# EAGLE design EmprendaR4b (EAGLE 8.0.0)
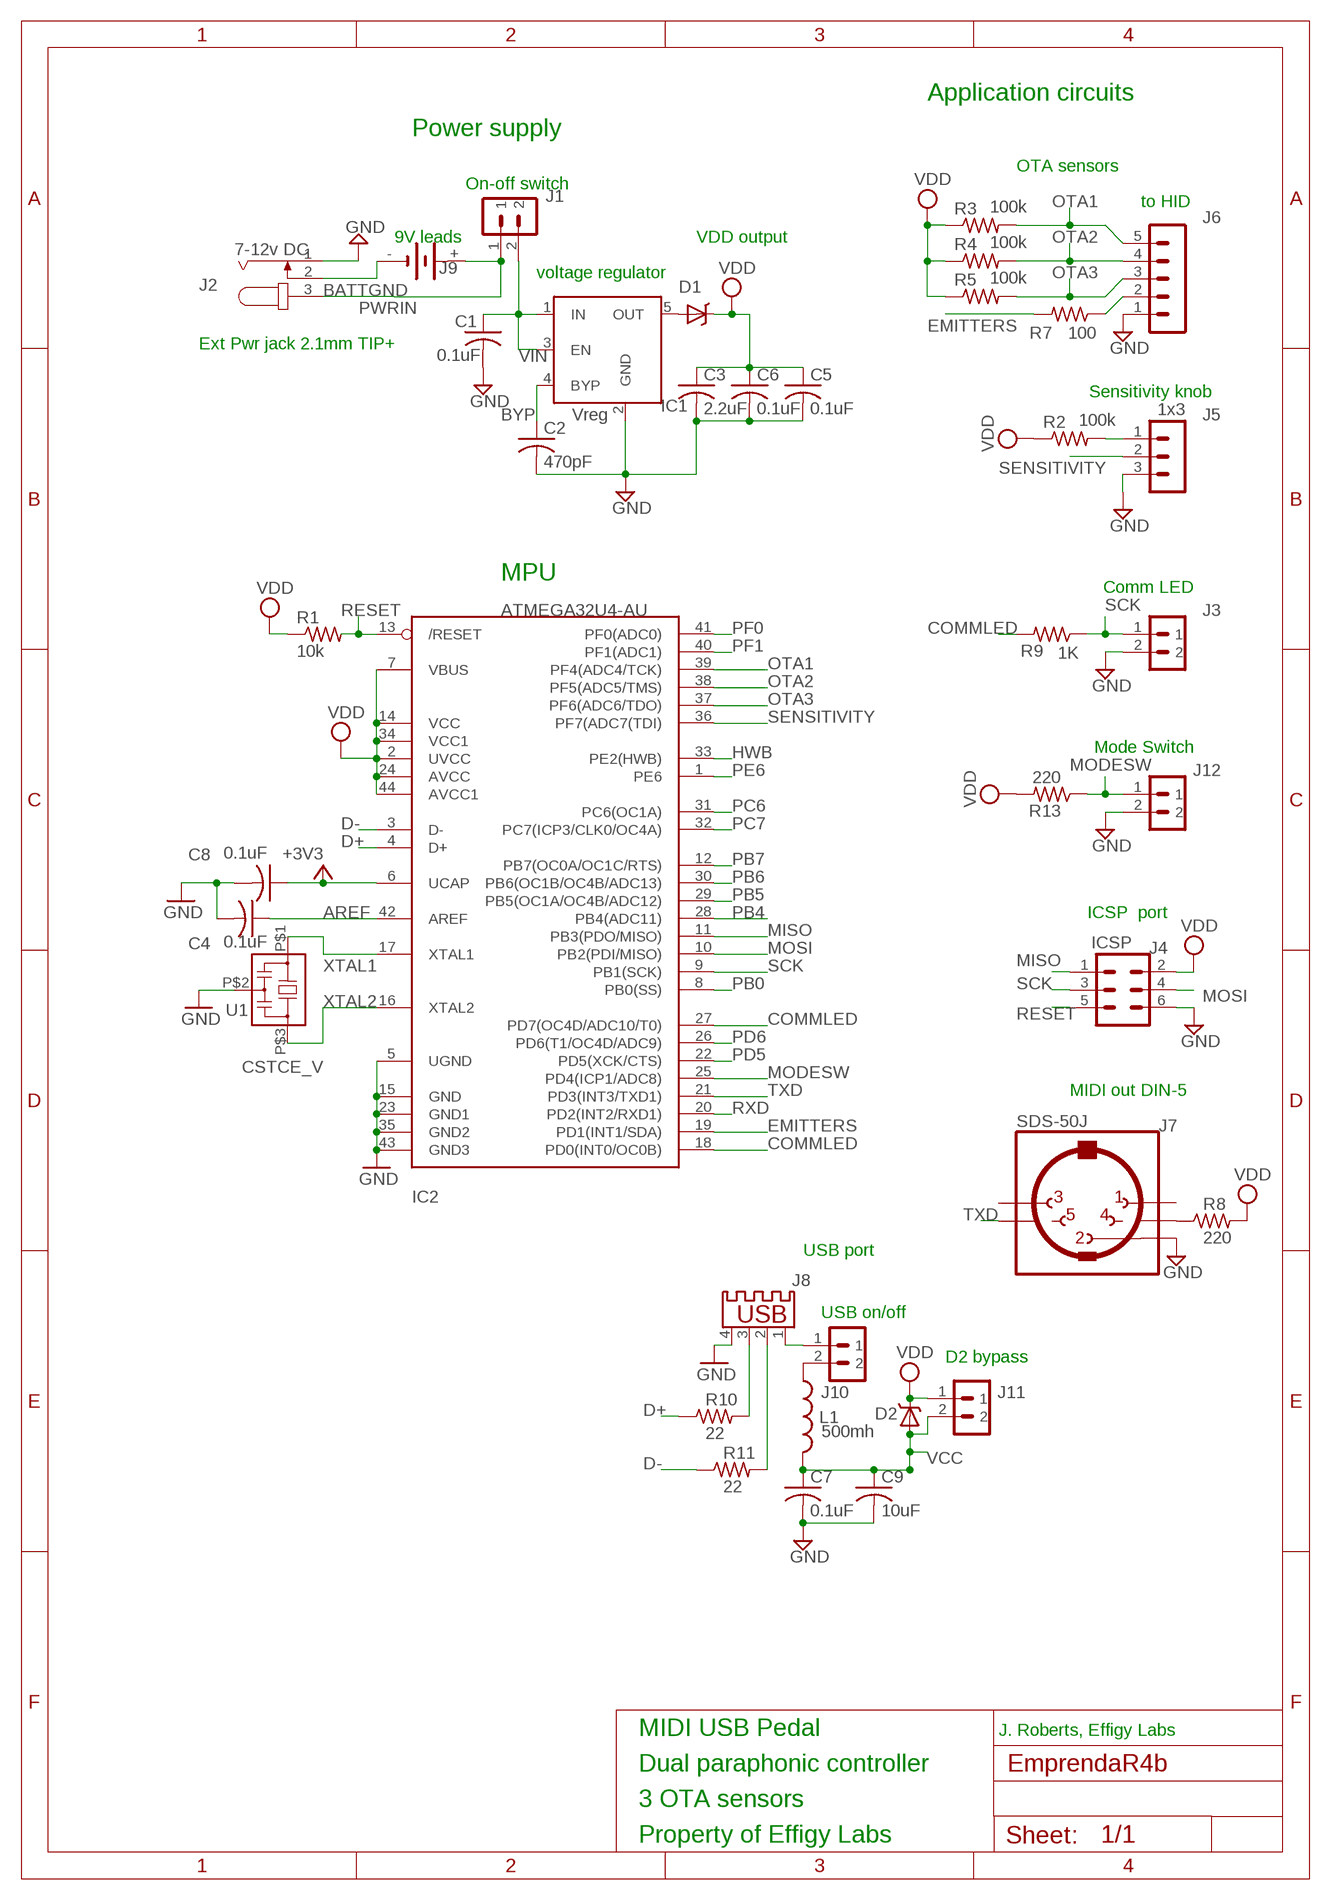
[diagram p0: schematic, sheet 1]

## Parts
C1  0.1uF  C-USC1206  [C1206]
C2  470pF  C-USC0603  [C0603]
C3  2.2uF  C-USC1206  [C1206]
C4  0.1uF  C-USC0603  [C0603]
C5  0.1uF  C-USC0603  [C0603]
C6  0.1uF  C-USC0603  [C0603]
C7  0.1uF  C-USC1206  [C1206]
C8  0.1uF  C-USC0603  [C0603]
C9  10uF  C-USC1206  [C1206]
D1  DIODE-SCHOTTKY_  [SMA-DIODE]
D2  DIODE-SCHOTTKY_  [SMA-DIODE]
IC1  Vreg  MIC5219XX  [SOT23-5]
IC2  ATMEGA32U4-AU  [TQFP44]
J1  SW1  MA02-1  [MA02-1]
J2  7-12v DC  JACK-PLUG0  [SPC4077]
J3  LED  MA02-1  [MA02-1]
J4  ICSP  MA03-2  [MA03-2]
J5  1x3  MA03-1  [MA03-1]
J6  Pedal  MA05-1  [MA05-1]
J7  SDS-50J  SDS-50JSDS-50J  [SDS-50J]
J8  B  61729-0010BLF61729-0010BLF  [61729-0010BLF]
J9  BATTERY-9V  [9V-BATTERY-SNAP]
J10  SW1  MA02-1  [MA02-1]
J11  USB-vdd  MA02-1  [MA02-1]
J12  LED  MA02-1  [MA02-1]
L1  500mh  INDUCTOR0805  [0805]
R1  10k  R-US_R0805  [R0805]
R2  100k  R-US_R0805  [R0805]
R3  100k  R-US_R0805  [R0805]
R4  100k  R-US_R0805  [R0805]
R5  100k  R-US_R0805  [R0805]
R7  100  R-US_R0805  [R0805]
R8  220  R-US_R0805  [R0805]
R9  1K  R-US_R0805  [R0805]
R10  22  R-US_R0805  [R0805]
R11  22  R-US_R0805  [R0805]
R13  220  R-US_R0805  [R0805]
U1  CSTCE_V  [CSTCE_V]

## Nets
+3V3: C8.1 IC2.6(UCAP)
AREF: C4.1 IC2.42(AREF)
BATTGND [bat]: J2.2 J9.-
BYP: C2.1 IC1.4(BYP)
COMMLED: IC2.18(PD0(INT0/OC0B)) IC2.27(PD7(OC4D/ADC10/T0)) R9.2
D+: IC2.4(D+) R10.1
D-: IC2.3(D-) R11.1
EMITTERS: IC2.19(PD1(INT1/SDA)) R7.2
EP: J6.2 R7.1
GND [gnd]: C1.2 C2.2 C3.2 C4.2 C5.2 C6.2 C7.2 C8.2 C9.2 IC1.2(GND) IC2.5(UGND) IC2.15(GND) IC2.23(GND1) IC2.35(GND2) IC2.43(GND3) J2.1 J3.2 J4.6 J5.3 J6.1 J7.P$2 J8.4 J12.2 U1.P$2
HWB: IC2.33(PE2(HWB))
MIDIPWR: J7.P$4 R8.1
MISO: IC2.11(PB3(PDO/MISO)) J4.1
MODESW: IC2.25(PD4(ICP1/ADC8)) J12.1 R13.1
MOSI: IC2.10(PB2(PDI/MISO)) J4.4
N$8 [power]: J8.1 J10.1
OTA1: IC2.39(PF4(ADC4/TCK)) J6.5 R3.2
OTA2: IC2.38(PF5(ADC5/TMS)) J6.4 R4.2
OTA3: IC2.37(PF6(ADC6/TDO)) J6.3 R5.2
PB0: IC2.8(PB0(SS))
PB4: IC2.28(PB4(ADC11))
PB5: IC2.29(PB5(OC1A/OC4B/ADC12))
PB6: IC2.30(PB6(OC1B/OC4B/ADC13))
PB7: IC2.12(PB7(OC0A/OC1C/RTS))
PC6: IC2.31(PC6(OC1A))
PC7: IC2.32(PC7(ICP3/CLK0/OC4A))
PD5: IC2.22(PD5(XCK/CTS))
PD6: IC2.26(PD6(T1/OC4D/ADC9))
PE6: IC2.1(PE6)
PF0: IC2.41(PF0(ADC0))
PF1: IC2.40(PF1(ADC1))
PWRIN [bat]: J1.1 J2.3 J9.+
RESET: IC2.13(/RESET) J4.5 R1.2
RVOUT [power]: D1.A IC1.5(OUT)
RXD: IC2.20(PD2(INT2/RXD1))
SCK: IC2.9(PB1(SCK)) J3.1 J4.3 R9.1
SENSITIVITY: IC2.36(PF7(ADC7(TDI)) J5.2
SENSPWR: J5.1 R2.2
TXD: IC2.21(PD3(INT3/TXD1)) J7.P$5
USB_D+: J8.3 R10.2
USB_D-: J8.2 R11.2
VBUS [power]: J10.2 L1.1
VCC [power]: C7.1 C9.1 D2.A J11.2 L1.2
VDD [power]: C3.1 C5.1 C6.1 D1.C D2.C IC2.2(UVCC) IC2.7(VBUS) IC2.14(VCC) IC2.24(AVCC) IC2.34(VCC1) IC2.44(AVCC1) J4.2 J11.1 R1.1 R2.1 R3.1 R4.1 R5.1 R8.2 R13.2
VIN [power]: C1.1 IC1.1(IN) IC1.3(EN) J1.2
XTAL1: IC2.17(XTAL1) U1.P$1
XTAL2: IC2.16(XTAL2) U1.P$3
Unconnected: J7.P$1 J7.P$3

## Notes on the sheet
- Application circuits
- Power supply
- OTA sensors
- On-off switch
- to HID
- 9V leads | VDD output
- voltage regulator
- Ext Pwr jack 2.1mm TIP+
- Sensitivity knob
- MPU | Comm LED
- Mode Switch
- ICSP  port
- MIDI out DIN-5
- USB port
- USB on/off
- D2 bypass
- MIDI USB Pedal | J. Roberts, Effigy Labs
- Dual paraphonic controller
- 3 OTA sensors
- Property of Effigy Labs

## Library data of the parts
C1 = rcl:C-US: CAPACITOR, American symbol; MF: AVX CORPORATION; MPN: 0603YC104KAT2A; OC_DIGI-KEY: 478-1239-1-ND; OC_NEWARK: 85K9474
C2 = rcl:C-US: CAPACITOR, American symbol; MF: TDK CORPORATION; MPN: C1608X7R1H471K; OC_DIGI-KEY: 445-1307-1-ND; OC_NEWARK: 96M1104
C3 C5-C9 = rcl:C-US: CAPACITOR, American symbol
C4 = rcl:C-US: CAPACITOR, American symbol; MF: AVX CORPORATION; MPN: 0603YC104KAT2A; OC_DIGIKEY: 478-1239-1-ND; OC_NEWARK: 85K9474
D1 D2 = SparkFun-DiscreteSemi:DIODE-SCHOTTKY: Commonly MBRA140.
IC1 = v-reg-micrel:MIC5219XX: VOLTAGE REGULATOR; MF: Exar; MPN: SPX5205M5-L-5-0; OC_DIGI-KEY: 1016-1419-ND; OC_NEWARK: unknown
IC2 = adaprog:ATMEGA32U4
J1 J3 J10-J12 = divers:MA02-1: PIN HEADER
J2 = con-jack:JACK-PLUG: DC POWER JACK Power Jack, DC, Right Angle, Through Hole, Rated 5A at 16VDC, PC Terminals Distributor: Farnell (www.Farnell.de) Drawing: 84N1161.pdf / 84N1162.pdf Manufacturer: SPC Technology (www.spctechnology.com) Type: SPC4077 / SPC 4078; MF: SPC; MPN: SPC21364; OC_FARNELL: unknown; OC_NEWARK: 11M0559
J4 = con-lstb:MA03-2: PIN HEADER; MF: FCI; MPN: 20021111-00006T4LF; OC_DIGI-KEY: 609-3710-ND; OC_NEWARK: unknown
J5 = con-lstb:MA03-1: PIN HEADER; OC_FARNELL: unknown; OC_NEWARK: unknown
J6 = con-lstb:MA05-1: PIN HEADER; MF: JST Sales America; MPN: 05HR-6S-P-N; OC_DIGI-KEY: 05HR-6S-P-N<-ND; OC_FARNELL: unknown; OC_NEWARK: unknown
J7 = cui_sds:SDS-50J; VALUE: J7
J8 = con-fci-usb:61729-0010BLF: USB connector
J9 = Power Jacks:BATTERY-9V: 9V battery; OC_NEWARK: unknown
L1 = SparkFun-Passives:INDUCTOR: Inductors Basic Inductor/Choke - 0603 and 1206. Footprints are not proven and vary greatly between part numbers.
R1 = resistor:R-US_: RESISTOR, American symbol; MF: Panasonic Electronic Components; MPN: ERJ-3EKF1002V; OC_DIGI-KEY: P10KACT-ND; OC_NEWARK: unknown
R2-R5 R7 R8 R13 = resistor:R-US_: RESISTOR, American symbol; MF: Panasonic Electronic Components; MPN: ERJ-6GEYJ104V; OC_DIGI-KEY: P100KACT-ND
R9 = resistor:R-US_: RESISTOR, American symbol; MF: Panasonic Electronic Components; MPN: ERJ-6GEYJ103V; OC_DIGI-KEY: P10KACT-ND
R10 R11 = resistor:R-US_: RESISTOR, American symbol
U1 = murata-filter:CSTCE_V; MF: Murata Electronics North America; MPN: CSTCE16M0V53-R0; OC_DIGI-KEY: 490-1198-1-ND; OC_NEWARK: unknown

## Net classes
0 default: width 0.305 mm, drill 0.559 mm, clearance 0.254 mm
1 power: width 0.406 mm, drill 0.559 mm, clearance 0.254 mm
2 gnd: width 0.406 mm, drill 0.559 mm, clearance 0.254 mm
3 bat: width 0.61 mm, drill 0.559 mm, clearance 0.254 mm

## Board
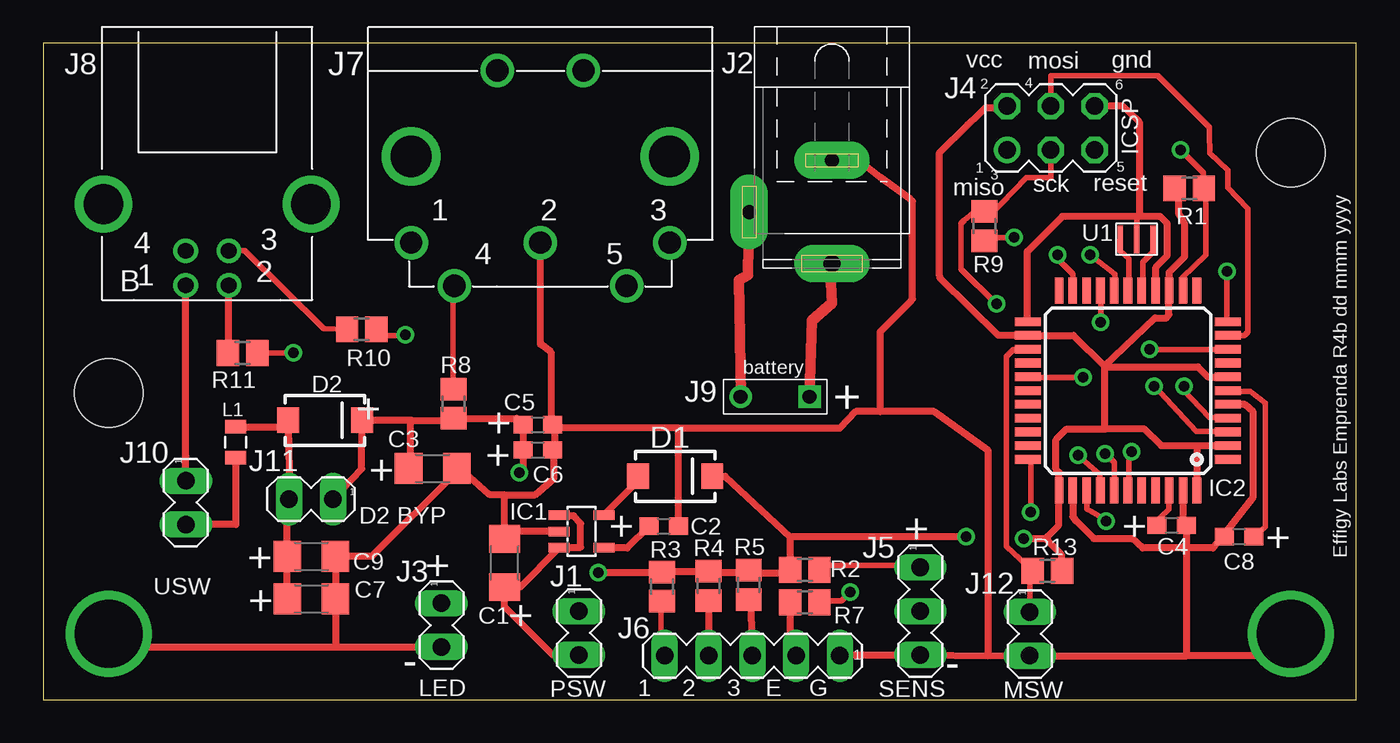
[diagram p1: board, top side]
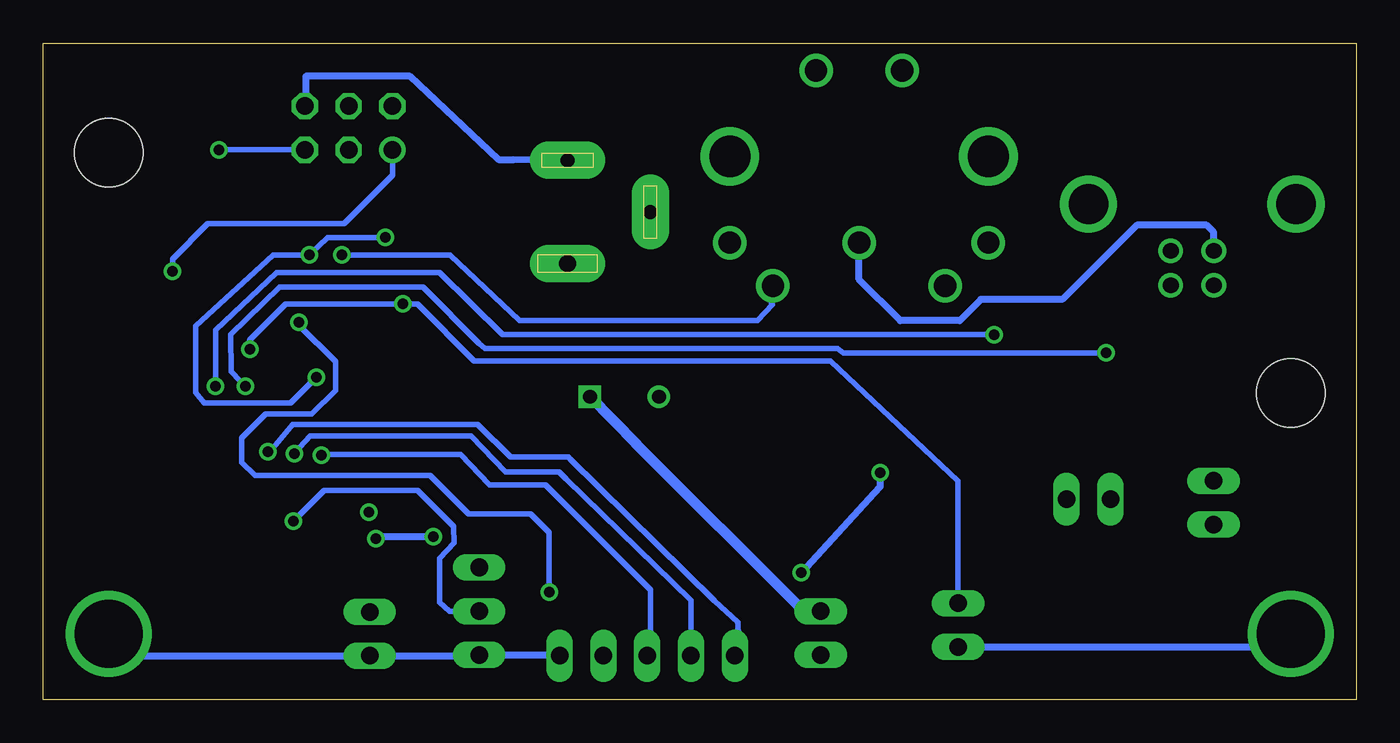
[diagram p2: board, bottom side, seen from below]

Size 76.2 x 38.1 mm. Coordinates in mm from the lower left corner, seen from the top.
Outline: 0,0 76.2,0 76.2,38.1 0,38.1 0,0
Copper layers (1*16): Top 0.035mm / dielectric 1.5mm / Bottom 0.035mm
Design rules "default *": minimum track width 10mil, minimum drill 24mil, track to track 8mil, track to pad 8mil, pad to pad 8mil, via to via 8mil, smd to smd 8mil, copper to edge 40mil, drill to drill 8mil, minimum pad ring 10mil, minimum via ring 8mil, stop-mask expansion 4mil, vias tented up to drill 0mil, thermal gap 10mil
Holes 3.96 mm at 72.39,31.75 3.81,17.78
tKeepout: area 8.9,22.6 to 11.4,24.7; area 53.3,30.1 to 62,35.9; area 7.3,21.2 to 12.7,26.3; area 19.9,21.5 to 37.9,27.2; area 32.7,2.5 to 35.7,5.4; area 25.9,2.6 to 28.9,5.2; area 53.3,3 to 54.9,4.5; area 53.2,5.5 to 55,7.1; area 58.7,3.2 to 60.4,4.4; area 64.2,3 to 66.2,4.7; area 6.7,11.3 to 9,13.7; area 13.9,8 to 16.4,9.8
bKeepout: area 69.2,32.4 to 77.8,38.2; area 38.2,21.9 to 48.8,31.6; area 45.4,0.3 to 59.9,5.1; area 7.6,21.1 to 12.9,26.1; area 33.2,2.4 to 35.2,4.9; area 26.6,2.9 to 28.2,4.9; area 53.7,2.7 to 54.8,7.3; area 59,2.7 to 59.7,4.6; area 7.4,11.7 to 8.7,13.1; area 13.8,8.4 to 15.4,9.6
tRestrict: area 31,1.8 to 31.8,3.8
bRestrict: area 55,31.8 to 60,34.2; area 62.2,4.9 to 63.3,7.1; area 56.1,1.7 to 57.2,3.8; area 51.1,1.6 to 52,3.8; area 40.8,1.8 to 41.7,4.1; area 30.8,1.7 to 32,3.8; area 29.9,7.2 to 31.1,10.7

### Footprints (pad centres in the part's own frame; a part is rotated, then mirrored left to right if it is on the bottom)
C1206 = smd 1.6 x 1.8: 1 -1.4,0; 2 1.4,0
C0603 = smd 1.1 x 1: 1 -0.85,0; 2 0.85,0
SMA-DIODE = smd 1.27 x 1.47: A -2.15,0; C 2.15,0
SOT23-5 = smd 0.55 x 1.2: 1 -0.95,-1.3; 2 0,-1.3; 3 0.95,-1.3; 4 0.95,1.3; 5 -0.95,1.3
TQFP44 = smd 1.5 x 0.5: 1 -5.8,4; 2 -5.8,3.2; 3 -5.8,2.4; 4 -5.8,1.6; 5 -5.8,0.8; 6 -5.8,0; 7 -5.8,-0.8; 8 -5.8,-1.6; 9 -5.8,-2.4; 10 -5.8,-3.2; 11 -5.8,-4; 23 5.8,-4; 24 5.8,-3.2; 25 5.8,-2.4; 26 5.8,-1.6; 27 5.8,-0.8; 28 5.8,0; 29 5.8,0.8; 30 5.8,1.6; 31 5.8,2.4; 32 5.8,3.2; 33 5.8,4 | smd 0.5 x 1.5: 12 -4,-5.8; 13 -3.2,-5.8; 14 -2.4,-5.8; 15 -1.6,-5.8; 16 -0.8,-5.8; 17 0,-5.8; 18 0.8,-5.8; 19 1.6,-5.8; 20 2.4,-5.8; 21 3.2,-5.8; 22 4,-5.8; 34 4,5.8; 35 3.2,5.8; 36 2.4,5.8; 37 1.6,5.8; 38 0.8,5.8; 39 0,5.8; 40 -0.8,5.8; 41 -1.6,5.8; 42 -2.4,5.8; 43 -3.2,5.8; 44 -4,5.8
MA02-1 = drill 1.016 long: 1 -2.54,0; 2 0,0
SPC4077 = drill 0.8 pad 2.184 long: 1 -3,0; 2 0,-4.8 | drill 1 pad 2.184 long: 3 3,0
MA03-2 = drill 1.016: 1 -2.54,-1.27 | drill 1.016 octagon: 2 -2.54,1.27; 3 0,-1.27; 4 0,1.27; 5 2.54,-1.27; 6 2.54,1.27
MA03-1 = drill 1.016 long: 1 -2.54,0; 2 0,0; 3 2.54,0
MA05-1 = drill 1.016 long: 1 -5.08,0; 2 -2.54,0; 3 0,0; 4 2.54,0; 5 5.08,0
SDS-50J = drill 1.295: P$1 -7.5,0; P$2 0,0; P$3 7.5,0; P$4 -5,-2.5; P$5 5,-2.5; P$6 -2.502,10; P$7 2.502,10 | drill 2.388: P$8 -7.5,5.004; P$9 7.5,5.004
61729-0010BLF = drill 0.92: 1 -1.25,-4.71; 2 1.25,-4.71; 3 1.25,-2.71; 4 -1.25,-2.71 | drill 2.3: NC 6.02,0; NC2 -6.02,0
9V-BATTERY-SNAP = drill 0.8 square: + -2,0 | drill 0.8: - 2,0
0805 = smd 0.8 x 1.2: 1 -0.9,0; 2 0.9,0
R0805 = smd 1.3 x 1.5: 1 -0.85,0; 2 0.85,0
CSTCE_V = smd 0.3 x 1.6: P$1 -0.95,0; P$2 0,0; P$3 0.95,0

### Placement (x,y rotation side)
C1  26.77,7.92 90 top
C2  36.02,10.06 0 top
C3  22.61,13.41 0 top
C4  65.48,10.11 0 top
C5  28.7,15.95 0 top
C6  28.7,14.48 0 top
C7  15.57,5.84 0 top
C8  69.39,9.45 180 top
C9  15.57,8.31 0 top
D1  36.68,12.95 0 top
D2  16.36,16.21 0 top
IC1  31.24,9.75 270 top
IC2  62.94,17.93 180 top
J1  31.09,2.59 270 top
J2  45.77,28.3 270 top
J3  23.11,3.05 270 top
J4  58.47,33.17 0 top
J5  50.9,5.13 270 top
J6  41.15,2.54 180 top
J7  28.85,26.52 0 top
J8  9.53,28.75 0 top
J9  42.47,17.58 180 top
J10  8.28,10.16 270 top
J11  14.27,11.63 180 top
J12  57.25,2.54 270 top
L1  11.18,14.94 90 top
R1  66.5,29.67 0 top
R2  44.2,7.52 0 top
R3  35.92,6.55 270 top
R4  38.61,6.6 270 top
R5  40.94,6.65 270 top
R7  44.2,5.64 0 top
R8  23.83,17.17 270 top
R9  54.61,27.48 270 top
R10  18.49,21.49 180 top
R11  11.58,20.12 180 top
R13  58.27,7.47 0 top
U1  63.45,26.72 0 top

### Tracks (layer width: path | path; a pad name or v marks a point on that pad's centre or on a via)
+3V3
  Top 0.305: IC2.6 68.89,17.88 70.05,17.88 70.92,17.22 70.92,10.02 C8.1
AREF
  Top 0.305: C4.1 64.82,10.57 65.33,11.02 65.33,12.04 IC2.42
BATTGND
  Top 0.61: J2.2 40.89,24.64 40.39,24.33 40.49,17.56 J9.-
BYP
  Top 0.305: IC1.4 32.61,8.89
  Top 0.406: C2.1 35.15,10.06 33.88,8.79 32.56,8.79 IC1.4
COMMLED  (via drill 0.61)
  Top 0.305: 62.18,23.57 IC2.18 62.18,23.77 62.18,24.69 v60.76,25.81 | 57.1,18.69 IC2.27 57.3,18.69 v60.35,18.69 | v56.34,26.82 54.66,26.82 R9.2
  Bottom 0.305: v56.34,26.82 59.69,26.82 v60.76,25.81 62.84,25.81 67.36,21.69 67.36,17.83 66.85,17.22 61.82,17.22 v60.35,18.69
D+  (via drill 0.61)
  Top 0.305: IC2.4 68.68,16.36 67.67,16.36 66.19,17.93 v66.19,18.19 | v21.03,21.18 20.98,21.13 19.71,21.13 19.51,21.34 R10.1
  Top 0.406: 68.72,16.31 IC2.4
  Bottom 0.305: v21.03,21.18 49.53,21.18 53.19,24.79 62.64,24.79 66.19,21.44 v66.19,18.19
D-  (via drill 0.61)
  Top 0.305: v14.53,20.12 R11.1 | 68.78,15.49 IC2.3 68.68,15.54 66.9,15.54 v64.47,18.19
  Bottom 0.305: v14.53,20.12 29.77,20.12 30.12,20.37 50.55,20.37 50.9,20.68 54.15,23.93 62.48,23.93 65.33,21.18 65.28,19.05 64.77,18.49 v64.47,18.19
EMITTERS  (via drill 0.61)
  Top 0.305: v46.84,6.25 46.33,5.74 45.21,5.74 R7.2 | IC2.19 61.37,23.57 v61.37,21.89
  Bottom 0.305: v46.84,6.25 46.84,9.7 47.9,10.77 51.51,10.77 53.75,13.01 63.91,13.01 64.67,13.77 64.67,15.19 63.3,16.56 60.6,16.56 59.23,17.93 59.23,19.61 61.37,21.74 v61.37,21.89
EP
  Top 0.406: R7.1 43.33,3.06 J6.2
GND  (via drill 3.96 pad 3.81)
  Top 0.305: 63.45,28.04 U1.P$2 | C8.2 68.48,9.45 68.37,9.34 | 29.46,16.04 C5.2
  Top 0.406: J4.6 62.64,34.44 63.6,33.53 63.6,28.04 | 63.6,28.04 64.82,28.04 65.23,27.64 65.23,25.76 64.57,25.09 64.57,23.72 IC2.15 | 63.6,28.04 63.45,28.04 59.13,28.04 57.1,26.01 57.1,21.95 IC2.23 | IC2.35 59.74,11.99 59.74,10.62 59.94,10.36 60.96,9.35 63.2,9.35 63.8,8.79 66.29,8.79 | 29.67,16.05 C5.2 | 66.34,8.79 66.34,2.56 | 47.4,31.24 J2.1 47.22,31.29 47.3,31.29 48.56,30.31 50.34,29.01 50.44,28.91 50.44,23.25 50.34,23.11 48.56,21.34 48.56,16.71 | 36.78,15.75 29.72,15.75 29.74,15.83 29.67,15.83 C5.2 | 36.78,15.75 46.23,15.75 47.14,16.71 48.56,16.71 | IC2.5 68.89,17.12 69.75,17.12 70.21,16.71 70.21,11.73 68.37,9.34 67.9,8.82 67.87,8.79 66.34,8.79 | v3.81,3.81 4.57,3.05 16.97,3.05 | C5.2 29.67,15.65 29.67,14.63 C6.2 29.62,14.41 29.62,12.8 29.43,12.64 28.55,11.89 26.77,11.89 | 26.77,11.89 25.91,11.89 24.18,13.41 C3.2 | 29.77,9.8 IC1.2 27.2,9.75 C1.2 26.77,11.89 | 24.59,12.8 C3.2 | 68.28,9.35 C8.2 | 66.34,8.79 66.29,8.79 | 66.33,8.83 66.34,8.79 | 66.09,8.79 66.14,8.79 66.24,8.94 66.34,8.79 | 16.97,3.05 C7.2 C9.2 17.07,8.33 19.1,8.33 23.98,13.21 C3.2 | 54.81,2.54 54.81,14.48 51.71,16.71 48.56,16.71 | IC2.43 66.14,10.3 C4.2 66.33,8.83 | 66.33,8.83 66.29,8.79 | 16.97,3.05 J3.2 | J7.P$2 28.85,20.62 29.46,20.17 29.46,16.04 | 29.46,16.05 C5.2 | C2.2 36.85,15.77 36.78,15.75 | J6.1 46.28,2.59 J5.3 54.81,2.54 | 54.81,2.54 57.2,2.59 J12.2 66.37,2.54 66.34,2.56 | v72.39,3.81 71.14,2.56 66.34,2.56
  Bottom 0.406: J2.1 46.63,31.29 48.92,31.32 49.78,31.34 54.91,36.17 60.96,36.17 60.96,34.54 J4.6 | J8.4 8.28,27.12 8.69,27.53 12.75,27.53 17.07,23.22 21.79,23.22 23.01,22 26.47,22 28.85,24.38 J7.P$2 | J3.2 4.57,3.05 v3.81,3.81 | v72.39,3.81 71.12,2.54 J12.2 50.95,2.54 J5.3 46.28,2.59 J6.1
HWB  (via drill 0.61)
  Top 0.305: v57.3,10.87 57.3,13.82 IC2.33
MIDIPWR
  Top 0.305: R8.1 23.77,18.09 23.77,22.96 J7.P$4
MISO  (via drill 0.61)
  Top 0.305: v68.68,24.84 68.68,21.95 IC2.11
  Bottom 0.305: J4.1 55.93,30.43 58.73,27.64 66.65,27.64 68.68,25.55 v68.68,24.84
MODESW
  Top 0.305: IC2.25 57.1,20.32 56.29,20.32 55.88,19.91 55.88,8.89 R13.1 57.25,7.21 J12.1
MOSI
  Top 0.305: IC2.10 68.89,21.13 69.7,21.13 69.9,21.34 69.9,28.5 68.73,29.72 68.73,30.73 67.68,31.72 67.67,32.85 67.67,33.22 64.67,36.22 58.47,36.22 J4.4 58.52,34.54
N$8
  Top 0.406: J10.1 8.28,14.12 J8.1
OTA1  (via drill 0.61)
  Top 0.305: R3.2 35.87,5.74 35.87,2.69 36.07,2.69 J6.5 | IC2.39 62.99,12.19 62.99,14.17 v63.14,14.38
  Bottom 0.305: 36.07,2.69 J6.5 35.83,2.78 35.88,4.47 | v63.14,14.38 62.99,14.43 61.72,15.95 51,15.95 49.07,14.07 45.72,14.07 45.62,13.97 37.24,5.74 35.88,4.47 | 35.88,4.47 35.92,4.48
OTA2  (via drill 0.61)
  Top 0.305: 62.18,11.99 IC2.38 62.14,13.75 v61.62,14.28
  Top 0.406: R4.2 J6.4
  Bottom 0.305: 45.87,12.81 45.91,12.85 | 45.87,12.81 R4.2 J6.4 | 61.61,14.25 v61.62,14.28 60.71,15.29 51.36,15.29 49.38,13.21 46.27,13.21 45.87,12.81
OTA3  (via drill 0.61)
  Top 0.305: 40.95,5.94 R5.2 | 61.37,11.99 IC2.37 61.32,13.06 v60.05,14.17
  Top 0.406: R5.2 41.05,5.71 J6.3
  Bottom 0.305: J6.3 40.95,2.74 40.95,6.36 46.79,12.21 47.04,12.45 50.29,12.45 51.97,14.22 59.84,14.22 v60.05,14.17
PWRIN
  Top 0.61: J2.3 45.72,24.18 45.77,23.01 44.6,22 J9.+
  Bottom 0.61: J1.1 31.19,5.13 31.09,5.18 32.11,5.18 41.81,14.83 41.78,14.83 J9.+
RESET  (via drill 0.61)
  Top 0.305: 66.24,23.57 IC2.13 66.04,23.77 66.09,24.49 67.46,25.81 67.46,29.67 R1.2 67.26,29.67 67.31,30.58 v65.99,31.9
  Bottom 0.305: J4.5 v65.99,31.9
RVOUT
  Top 0.406: D1.A 34.53,12.69 IC1.5
SCK  (via drill 0.61)
  Top 0.305: J4.3 58.47,30.28 | 58.47,30.28 58.47,30.26 | 68.89,20.32 IC2.9 68.68,20.32 v64.21,20.32 | v55.32,22.96 53.24,24.99 53.24,27.64 53.44,27.84 53.95,28.25 54.46,28.25 R9.1 | 54.86,28.04 54.66,28.04 R9.1 | 54.86,28.04 57.05,30.28 58.47,30.28 | 54.86,28.04 R9.1
  Bottom 0.305: J3.1 23.11,12.7 30.53,19.66 51.21,19.66 54.46,22.96 v55.32,22.96 62.13,22.96 64.21,20.88 v64.21,20.32
SENSITIVITY  (via drill 0.61)
  Top 0.305: 60.55,12.19 IC2.36 60.55,11.07 61.67,10.41 v61.67,10.36
  Bottom 0.305: J5.2 52.63,5.13 53.19,5.64 53.19,8.18 52.35,9.08 52.38,10.01 52.38,10.06 54.46,12.14 59.89,12.14 v61.67,10.36
SENSPWR
  Top 0.305: J5.1 50.9,7.77 45.21,7.77 R2.2
TXD  (via drill 0.61)
  Top 0.305: v58.88,25.81 58.88,25.55 59.74,24.69 59.74,23.77 IC2.21
  Bottom 0.305: v58.88,25.81 52.58,25.81 48.56,22 34.75,22 33.88,22.91 33.93,22.96 J7.P$5
USB_D+
  Top 0.305: 17.68,21.47 R10.2 16.27,21.52 11.68,26.06 10.88,26.06 J8.3
USB_D-
  Top 0.406: R11.2 10.78,20.12 J8.2
VBUS
  Top 0.406: L1.1 11.18,10.16 J10.2
VCC
  Top 0.406: D2.A 14.21,15.81 | 14.21,15.81 14.28,13.31 J11.2 14.28,11.17 14.17,11.06 C9.1 C7.1 | L1.2 14.21,15.81
VDD  (via drill 0.61)
  Top 0.305: 66.95,12.15 IC2.44
  Top 0.406: 40.95,7.37 38.71,7.37 R4.1 38.56,7.4 R3.1 35.7,7.4 35.66,7.37 v32.21,7.37 | 58.93,7.32 R13.2 59.08,7.35 59.08,8.43 58.27,9.25 | 58.27,9.25 58.27,9.45 58.93,10.11 58.93,11.99 IC2.34 58.94,13.2 58.78,13.36 58.78,15.09 59.38,15.7 61.51,15.7 61.57,15.81 | 23.98,16.46 R8.2 | v56.9,9.35 58.12,9.35 58.27,9.25 | 24.18,16.46 R8.2 | 40.95,7.37 43.18,7.37 R2.1 43.33,7.82 43.33,9.45 | 23.37,16.26 23.77,16.26 R8.2 | J4.2 55.83,34.34 54.66,34.34 54.25,33.93 53.65,33.38 52.02,31.75 52.02,24.59 52.07,24.43 55.42,21.13 57.1,21.13 IC2.24 57.3,21.13 59.79,21.13 61.57,19.36 | 40.95,7.37 R5.1 | v53.54,9.45 43.33,9.45 | 24.18,16.26 R8.2 | 65.38,23.62 IC2.14 | 66.95,12.15 66.95,14.68 67,14.73 | 68.68,18.69 IC2.7 | 68.48,18.69 IC2.7 | v27.64,13.16 27.85,13.32 C6.1 27.84,14.63 27.84,15.85 C5.1 27.48,16.32 R8.2 | J11.1 18.49,13.39 D2.C 21.39,16.2 | 21.23,13.38 C3.1 21.34,13.41 21.34,16.15 21.39,16.2 | IC2.7 68.28,18.69 67.61,18.69 67,19.3 61.62,19.3 61.57,19.36 | IC2.14 65.34,24.8 66.24,25.7 66.24,27.64 65.89,28.19 65.89,29.41 R1.1 | 61.57,19.36 64.52,22.15 65.18,22.15 65.33,22.35 65.33,22.71 IC2.14 | 61.57,19.36 61.57,15.81 | 61.57,15.81 61.62,15.7 63.91,15.7 64.87,14.73 67,14.73 | 67,14.73 IC2.2 | D1.C 39.57,12.95 43.33,9.45 | 21.39,16.2 23.71,16.2 R8.2
  Bottom 0.406: v53.54,9.45 56.79,9.45 v56.9,9.35 | v32.21,7.37 27.64,12.34 v27.64,13.16
VIN
  Top 0.406: J1.2 29.57,2.59 26.77,5.38 C1.1 27.66,6.53 IC1.3 29.97,8.84 31.19,8.84 31.19,10.21 30.79,10.67 29.97,10.67 IC1.1
  Bottom 0.406: 31.8,2.69 31.19,2.69 J1.2
XTAL1
  Top 0.305: IC2.17 62.99,23.77 62.99,25.6 62.48,26.06 62.48,26.67 U1.P$1
XTAL2
  Top 0.305: IC2.16 63.8,23.77 63.8,25.4 64.41,26.01 64.41,26.62 U1.P$3

### Text on the board
tPlace: vcc | mosi | gnd | J7 | 4 | 2 | 6 | ICSP | 1 | 5 | 3 | reset | miso | sck | U1 | battery | + | + | + | + | D2 BYP | + | + | + | + | Effigy Labs Emprenda R4b dd mmm yyyy | + | + | USW | + | + | - | - | MSW | LED | PSW | 1 | 2 | 3 | E | G | SENS